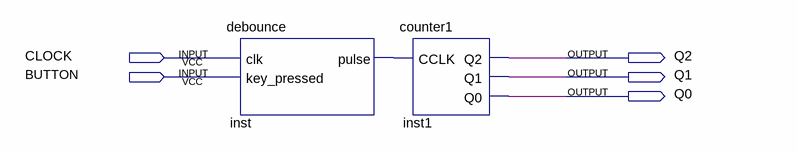
[diagram p0: schematic sheet]
// Quartus schematic test2.bdf as structural Verilog: 2 symbols, 5 pins
module test2 (
  input  CLOCK,
  input  BUTTON,
  output Q2,
  output Q1,
  output Q0
);

  wire inst_pulse;

  debounce inst (.clk(CLOCK), .key_pressed(BUTTON), .pulse(inst_pulse));
  counter1 inst1 (.CCLK(inst_pulse), .Q2(Q2), .Q1(Q1), .Q0(Q0));
endmodule
